# Altium schematic sheet ThermocoupleAmplifiersAD8494.SchDoc
size A
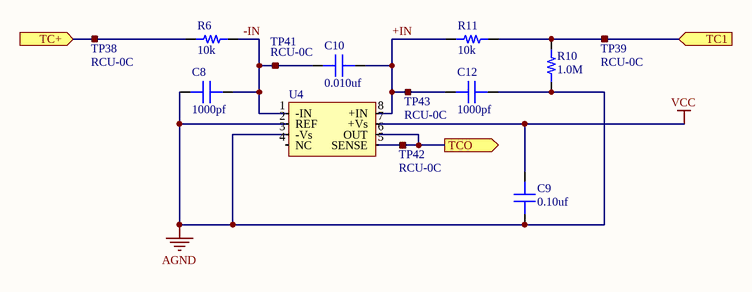
[diagram p0: ThermocoupleAmplifiersAD8494.SchDoc]

## Parts
C8  value 1000pf  [CAP 0603/1608]  (hidden comment: Capacitor MLCC 1000pf 16V CAP 0603/1608)
C9  value 0.10uf  [CAP 0603/1608]  (hidden comment: Capacitor MLCC 0.10uf 16V CAP 0603/1608)
C10  value 0.010uf  [CAP 0603/1608]  (hidden comment: Capacitor MLCC 0.010uf 16V CAP 0603/1608)
C12  value 1000pf  [CAP 0603/1608]  (hidden comment: Capacitor MLCC 1000pf 16V CAP 0603/1608)
R6  value 10k  [RES 0603/1608]  (hidden comment: Resistor 10k 0603 1/10W 10%)
R10  value 1.0M  [RES 0603/1608]  (hidden comment: Resistor 1.0M 0603 1/10W 5%)
R11  value 10k  [RES 0603/1608]  (hidden comment: Resistor 10k 0603 1/10W 10%)
TP38  RCU-0C  [RCU-0C]
TP39  RCU-0C  [RCU-0C]
TP41  RCU-0C  [RCU-0C]
TP42  RCU-0C  [RCU-0C]
TP43  RCU-0C  [RCU-0C]
U4  (no value)  [MSOP-8]

## Ports
TC1 (in), TC+ (in), TCO (out)

## Nets
AGND: C8.1 C9.1 C12.2 R10.1 U4.2(REF) U4.3(-Vs)
VCC: C9.2 U4.7(+Vs)
+IN: C10.2 C12.1 R11.1 TP43.1 U4.8(+IN)
-IN: C8.2 C10.1 R6.2 TP41.1 U4.1(-IN)
TC1: R10.2 R11.2 TP39.1 ; port TC1
TC+: R6.1 TP38.1 ; port TC+
TCO: TP42.1 U4.5(SENSE) U4.6(OUT) ; port TCO

Not connected (* = marked no-connect by the designer): U4 4(NC)

## Library data of the parts
C8 C12 = 193: Manufacturer_id: 1; idCapacitor: 193; Name: Cap_1000pf_16V_CAP 0603/1608; Dielectric: Ceramic; Created_By: Nick Mah; Drawer_id: 1; Voltage_Rating: 16V; Package: CAP 0603/1608; Created_Date: 10/20/2018
C9 = 223: Manufacturer_id: 1; idCapacitor: 223; Name: Cap_0.10uf_16V_CAP 0603/1608; Dielectric: Ceramic; Created_By: Nick Mah; Drawer_id: 1; Voltage_Rating: 16V; Package: CAP 0603/1608; Created_Date: 10/20/2018
C10 = 217: Manufacturer_id: 1; idCapacitor: 217; Name: Cap_0.010uf_16V_CAP 0603/1608; Dielectric: Ceramic; Created_By: Nick Mah; Drawer_id: 1; Voltage_Rating: 16V; Package: CAP 0603/1608; Created_Date: 10/20/2018
R6 R11 = 2317: Manufacturer_id: 1; idResistor: 2317; Name: Res_10k_0603_1/10W_10%; Created_By: Nick Mah; Supplier 1: Digi-Key; Drawer_id: 1; Tolerance: 10%; Power: 1/10W; Package: 0603; ComponentLink1Description: Datasheet; Created_Date: 2018-10-20
R10 = 1441: Manufacturer_id: 1; idResistor: 1441; Name: Res_1.0M_0603_1/10W_5%; Created_By: Nick Mah; Supplier 1: Digi-Key; Drawer_id: 1; Tolerance: 5%; Power: 1/10W; Package: 0603; ComponentLink1Description: Datasheet; Created_Date: 2018-10-20
TP38 TP39 TP41-TP43 = 14: Test point; Manufacturer_id: 1; idConn: 14; Value: CONN; Created_By: Graydon; Updated_By: Null; Drawer_id: 1; Name: RCU-0C; Num_Contacts: 1; Num_Rows: 1; Package: RCU-0C; MfrPartNo: RCU-0C; Link: https://www.digikey.com/product-detail/en/te-connectivity-amp-connectors/RCU-0C/A106145CT-ND/3477802; ComponentLink1Description: Null; ComponentLink1URL: Null; Supplier1: None; Supplier1PartNo: None; Created_Date: 11/10/2018
U4 = 3: IC THRMOCPLE COLD JNC COMP 8MSOP; Manufacturer_id: 1; MfrPartNo: AD8494CRMZ; idOp_Amp: 3; Name: AD8494 Thermocouple Amplifier; Value: K-type; Amplifier_Type: Thermocouple Amplifier; Supply_Voltage: +-18,2.7-36; Created_By: Nick Mah; Drawer_id: 1; Num_Circuits: 1; Package: MSOP8; Link: https://www.digikey.com/product-detail/en/analog-devices-inc/AD8494CRMZ/AD8494CRMZ-ND/2606669; ComponentLink1Description: Datasheet; ComponentLink1URL: http://www.digchip.com/data/041/041-93390-AD8494.pdf; Supplier1: Digi-Key; Supplier1PartNo: AD8494CRMZ-ND